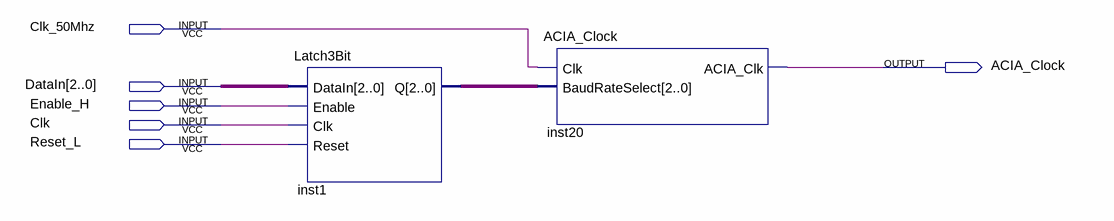
[diagram p0: schematic sheet]
// Quartus schematic ACIA_BaudRate_Generator.bdf as structural Verilog: 2 symbols, 6 pins
module ACIA_BaudRate_Generator (
  input  Clk_50Mhz,
  input  [2:0] DataIn,
  input  Enable_H,
  input  Clk,
  input  Reset_L,
  output ACIA_Clock
);

  wire [2:0] inst1_q;

  Latch3Bit inst1 (.DataIn(DataIn), .Enable(Enable_H), .Clk(Clk), .Reset(Reset_L), .Q(inst1_q));
  ACIA_Clock inst20 (.Clk(Clk_50Mhz), .BaudRateSelect(inst1_q), .ACIA_Clk(ACIA_Clock));
endmodule
